# EAGLE design isl29023 (EAGLE 7.3.0)
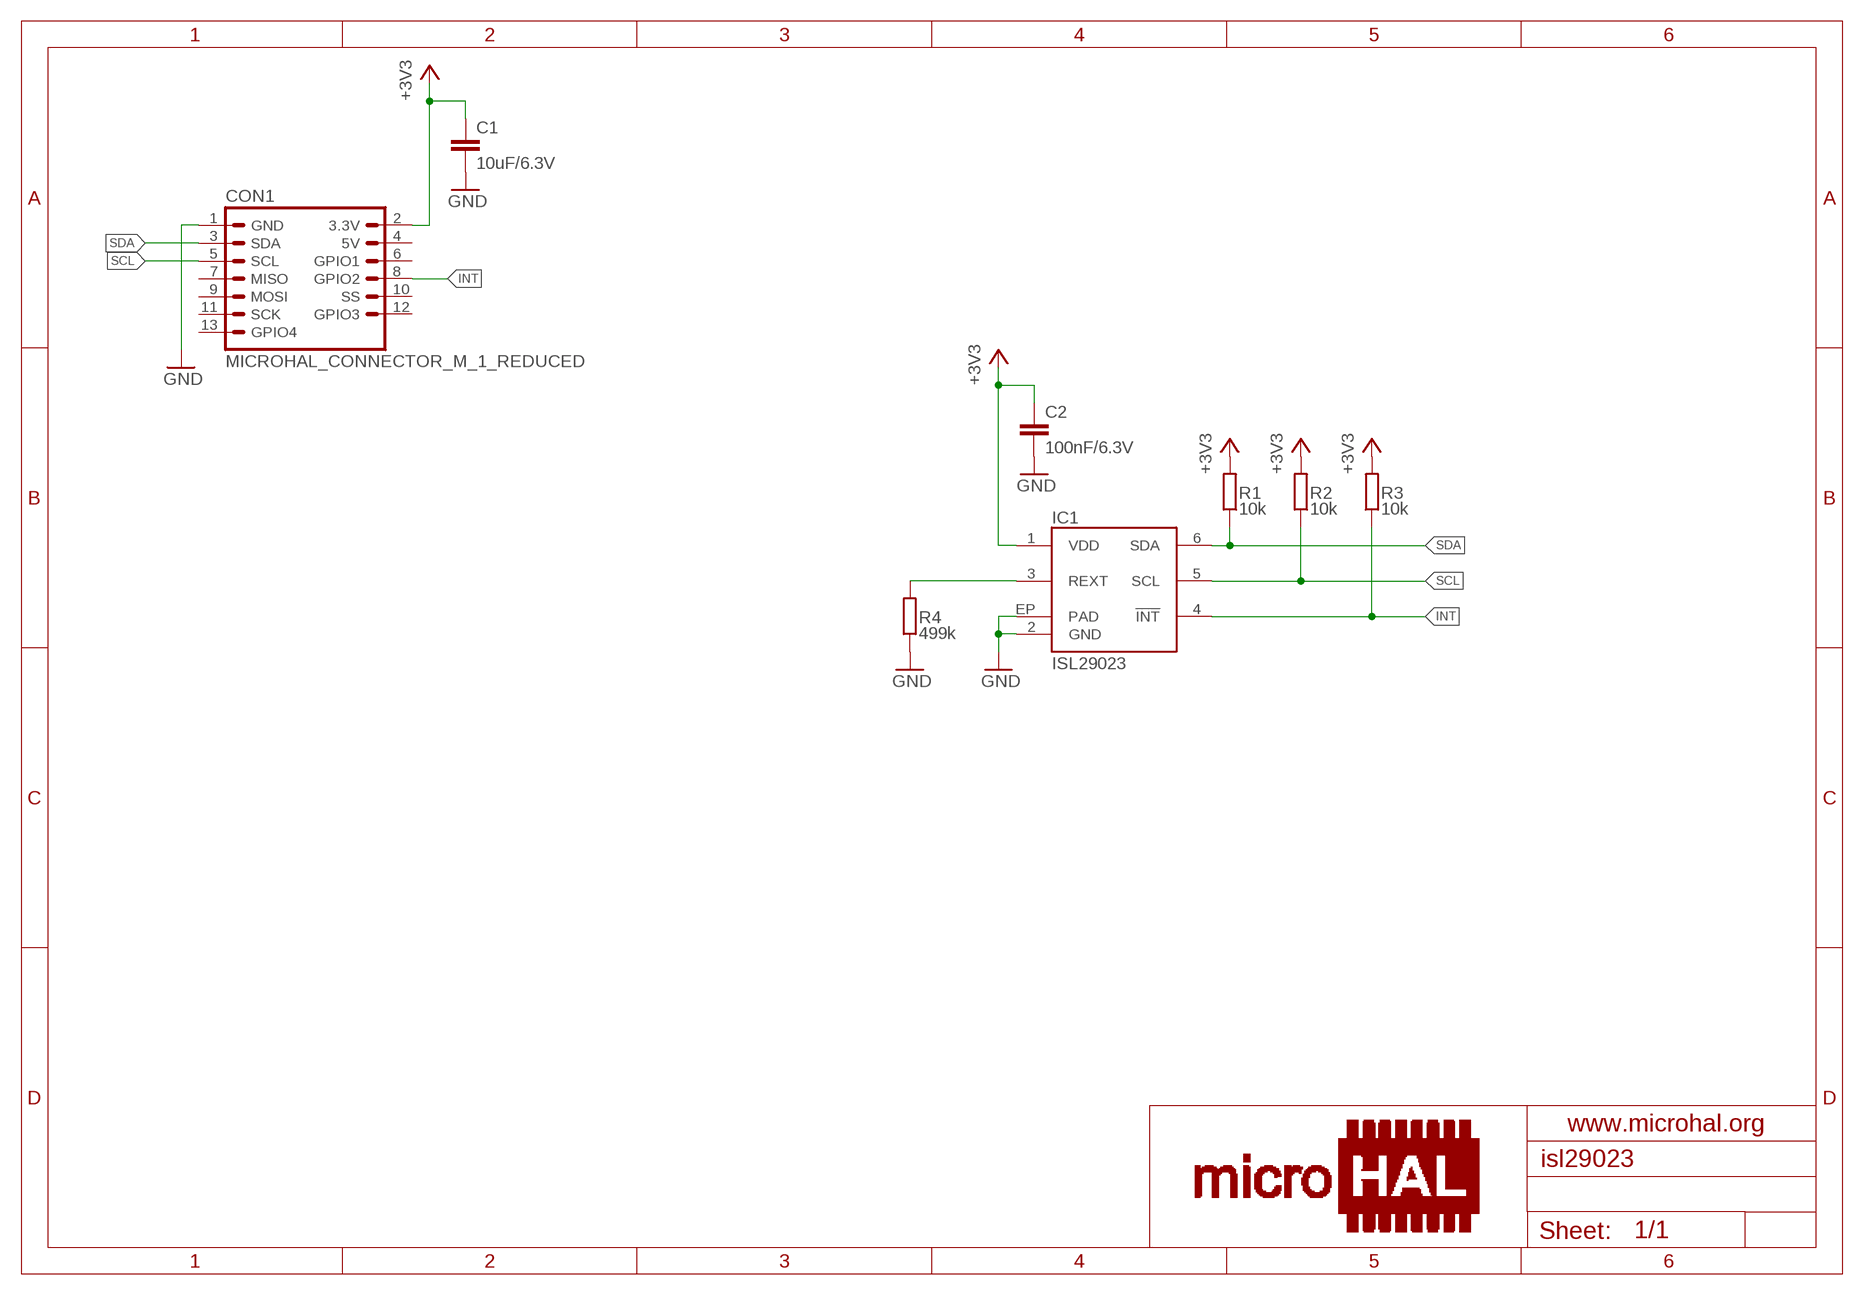
[diagram p0: schematic, sheet 1]

## Parts
C1  10uF/6.3V  C-EUC0805K  [C0805K]
C2  100nF/6.3V  C-EUC0603K  [C0603K]
CON1  MICROHAL_CONNECTOR_M_1_REDUCED  [MICROHAL_CONNECTOR_M_1_REDUCED_EDGE]
IC1  ISL29023  [ODFN-6]
R1  10k  R-EU_R0603  [R0603]
R2  10k  R-EU_R0603  [R0603]
R3  10k  R-EU_R0603  [R0603]
R4  499k  R-EU_R0603  [R0603]

## Nets
+3V3: C1.1 C2.1 CON1.2(3.3V) IC1.1(VDD) R1.2 R2.2 R3.2
GND: C1.2 C2.2 CON1.1(GND) IC1.2(GND) IC1.EP(PAD) R4.1
INT: CON1.8(GPIO2) IC1.4(!INT) R3.1
N$2: IC1.3(REXT) R4.2
SCL: CON1.5(SCL) IC1.5(SCL) R2.1
SDA: CON1.3(SDA) IC1.6(SDA) R1.1
Unconnected: CON1.4(5V) CON1.6(GPIO1) CON1.7(MISO) CON1.9(MOSI) CON1.10(SS) CON1.11(SCK) CON1.12(GPIO3) CON1.13(GPIO4)

## Library data of the parts
C1 C2 = rcl:C-EU: CAPACITOR, European symbol
CON1 = microhal-connector_v0.1:MICROHAL_CONNECTOR_M_1_REDUCED
IC1 = isl29023:ISL29023
R1-R4 = rcl:R-EU_: RESISTOR, European symbol

## Board
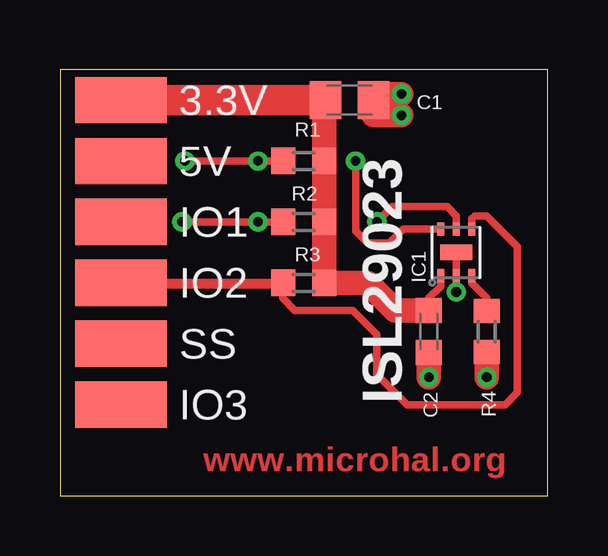
[diagram p1: board, top side]
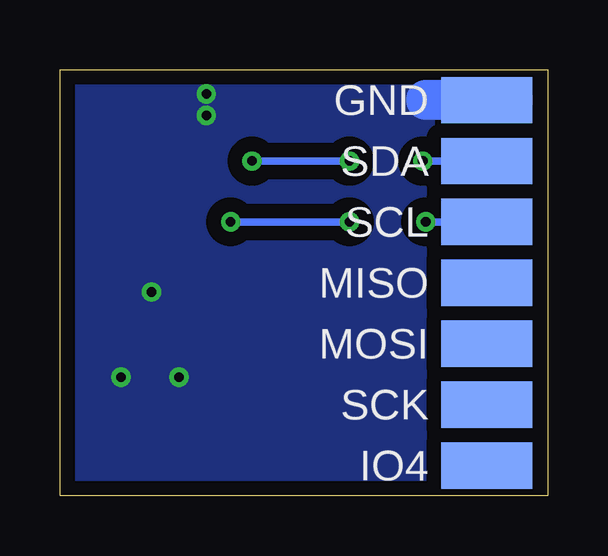
[diagram p2: board, bottom side, seen from below]

Size 20.32 x 17.78 mm. Coordinates in mm from the lower left corner, seen from the top.
Outline: 0,0 20.32,0 20.32,17.78 0,17.78 0,0
Copper layers (1*16): Top 0.035mm / dielectric 1.5mm / Bottom 0.035mm
Design rules "default *": minimum track width 10mil, minimum drill 14mil, track to track 8mil, track to pad 8mil, pad to pad 8mil, via to via 8mil, smd to smd 4mil, copper to edge 20mil, drill to drill 8mil, minimum pad ring 10mil, minimum via ring 8mil, stop-mask expansion 4mil, vias tented up to drill 16mil, thermal gap 10mil

### Footprints (pad centres in the part's own frame; a part is rotated, then mirrored left to right if it is on the bottom)
C0805K = smd 1.3 x 1.6: 1 -1,0; 2 1,0
C0603K = smd 1.05 x 1.08: 1 -0.875,0; 2 0.875,0
MICROHAL_CONNECTOR_M_1_REDUCED_EDGE = smd 1.93 x 3.81 bottom: 1 -7.62,0; 3 -5.08,0; 5 -2.54,0; 7 0,0; 9 2.54,0; 11 5.08,0; 13 7.62,0 | smd 1.93 x 3.81: 2 -7.62,0; 4 -5.08,0; 6 -2.54,0; 8 0,0; 10 2.54,0; 12 5.08,0
ODFN-6 = smd 0.55 x 0.3: 1 -0.975,0.65; 2 -0.975,0; 3 -0.975,-0.65; 4 0.975,-0.65; 5 0.975,0; 6 0.975,0.65 | smd 0.65 x 1.35: EP 0,0
R0603 = smd 1 x 1.1: 1 -0.85,0; 2 0.85,0

### Placement (x,y rotation side)
C1  12.06,16.51 0 top
C2  15.37,6.86 270 top
CON1  2.54,8.89 270 top
IC1  16.51,10.16 90 top
R1  10.16,13.97 0 top
R2  10.16,11.43 0 top
R3  10.16,8.89 0 top
R4  17.78,6.86 90 top

### Tracks (layer width: path | path; a pad name or v marks a point on that pad's centre or on a via)
+3V3
  Top 0.305: IC1.1 15.86,8.75 15.37,8.26 C2.1
  Top 1.016: C1.1 11.01,16.45 R1.2 R2.2 R3.2 12.83,8.89 13.97,7.75 15.35,7.75 C2.1
  Top 1.27: CON1.2 C1.1
GND  (via drill 0.4)
  Top 0.305: v16.51,8.51 IC1.2 IC1.EP
  Top 1.016: C2.2 v15.37,4.95 | R4.1 v17.78,4.95 | v14.22,16.76 13.06,16.76 C1.2 | v14.22,15.88 13.08,15.88 13.08,16.51
  Bottom 1.676: CON1.1 5.08,16.51
  pour Bottom (isolate 0.61): 0,17.78 20.32,17.78 20.32,0 0,0
INT
  Top 0.305: IC1.4 17.16,11.57 17.27,11.68 17.78,11.68 19.05,10.41 19.05,4.32 18.54,3.81 14.48,3.81 13.21,5.08 13.21,6.73 12.19,7.75 9.78,7.75 9.27,8.26 9.27,8.85 R3.1
  Top 0.406: 9.27,8.85 2.54,8.85 CON1.8
N$2
  Top 0.305: IC1.3 17.16,8.88 17.78,8.26 R4.2
SCL  (via drill 0.4)
  Top 0.305: IC1.5 16.51,11.68 16.13,12.06 13.84,12.06 v13.21,11.43 | R2.1 v8.26,11.43 v5.08,11.43
  Bottom 0.305: v13.21,11.43 v8.26,11.43 | CON1.5 v5.08,11.43
SDA  (via drill 0.4)
  Top 0.305: IC1.6 14.31,11.13 13.72,10.54 12.83,10.54 12.32,11.05 v12.32,13.97 | R1.1 v8.26,13.97 v5.21,13.97
  Bottom 0.305: v12.32,13.97 v8.26,13.97 | v5.21,13.97 CON1.3

### Text on the board
Top: www.microhal.org
tPlace: ISL29023
tStop: www.microhal.org